# Altium schematic sheet level_switch.SchDoc
size A4
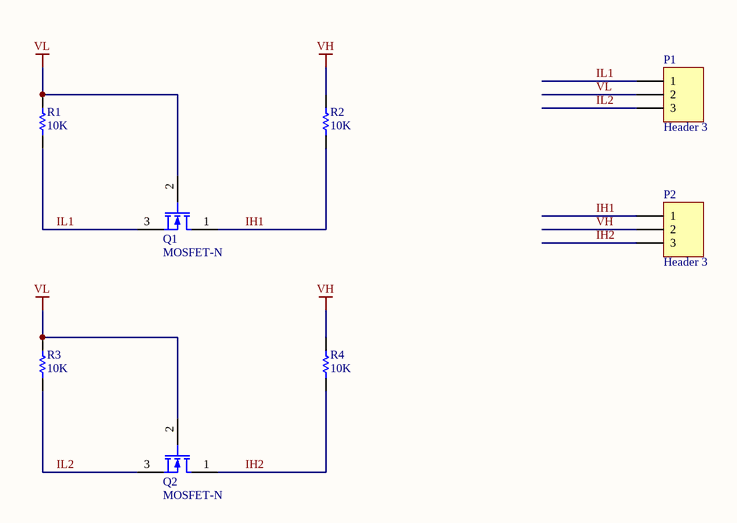
[diagram p0: level_switch.SchDoc]

## Parts
P1  Header 3  [HDR1X3]
P2  Header 3  [HDR1X3]
Q1  MOSFET-N  [SOT23-3-MOS]
Q2  MOSFET-N  [SOT23-3-MOS]
R1  value 10K  [R0603]  (hidden comment: Res1)
R2  value 10K  [R0603]  (hidden comment: Res1)
R3  value 10K  [R0603]  (hidden comment: Res1)
R4  value 10K  [R0603]  (hidden comment: Res1)

## Nets
VH: P2.2 R2.2 R4.2
VL: P1.2 Q1.2(G) Q2.2(G) R1.2 R3.2
IH1: P2.1 Q1.1(D) R2.1
IH2: P2.3 Q2.1(D) R4.1
IL1: P1.1 Q1.3(S) R1.1
IL2: P1.3 Q2.3(S) R3.1

## Library data of the parts
P1 P2 = Header 3: Header, 3-Pin; LatestRevisionDate: 17-Jul-2002; LatestRevisionNote: Re-released for DXP Platform.; Publisher: Altium Limited
Q1 Q2 = MOSFET-N: N-Channel MOSFET; Published: 8-Jun-2000; LatestRevisionDate: 17-Jul-2002; LatestRevisionNote: Re-released for DXP Platform.; PackageVersion: 1995/1996; PackageReference: E3; Publisher: Altium Limited; PackageDescription: TO, Flat Index; 3 In-Line, Axial Leads; Body Dia. 4.6mm; Lead Dia. 0.5 mm (max)
R1-R4 = Res1: Resistor; Published: 8-Jun-2000; LatestRevisionDate: 17-Jul-2002; LatestRevisionNote: Re-released for DXP Platform.; PackageReference: AXIAL-0.3; Publisher: Altium Limited; PackageDescription: Axial Device, Thru-Hole; 2 Leads; 0.3 in Pin Spacing